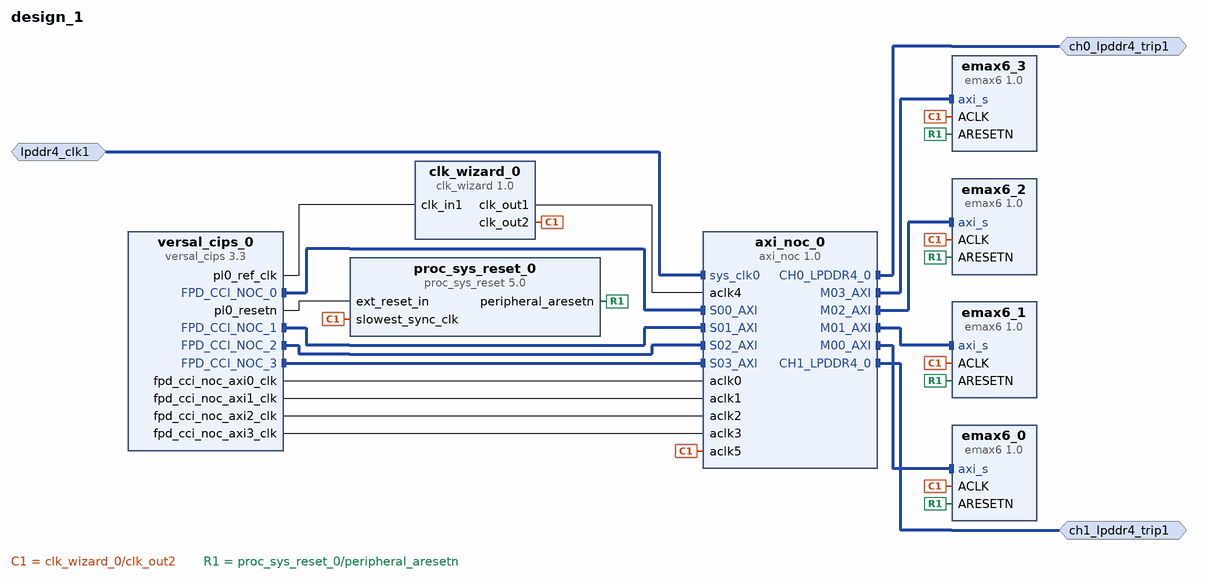
[diagram p0: block diagram of the top level]
# Vivado block design design_1, xcvp1802-lsvc4072-2MP-e-S, Vivado 2022.2.2
create_bd_design design_1

create_bd_intf_port -mode Master -vlnv xilinx.com:interface:lpddr4_rtl:1.0 ch0_lpddr4_trip1
create_bd_intf_port -mode Master -vlnv xilinx.com:interface:lpddr4_rtl:1.0 ch1_lpddr4_trip1
create_bd_intf_port -mode Slave -vlnv xilinx.com:interface:diff_clock_rtl:1.0 lpddr4_clk1
set_property -dict {CONFIG.FREQ_HZ 200000000} [get_bd_intf_ports lpddr4_clk1]

create_bd_cell -type ip -vlnv xilinx.com:ip:versal_cips:3.3 versal_cips_0
set_property -dict [list \
  CONFIG.BOOT_MODE Custom \
  CONFIG.CLOCK_MODE {REF CLK 33.33 MHz} \
  CONFIG.DDR_MEMORY_MODE Custom \
  CONFIG.DEBUG_MODE Custom \
  CONFIG.DESIGN_MODE 1 \
  CONFIG.PS_BOARD_INTERFACE Custom \
  CONFIG.PS_PMC_CONFIG {['CLOCK_MODE {REF CLK 33.33 MHz}', 'DDR_MEMORY_MODE Custom', 'DESIGN_MODE 1', 'DEVICE_INTEGRITY_MODE Custom', 'PMC_ALT_REF_CLK_FREQMHZ 33.333', 'PMC_CRP_EFUSE_REF_CTRL_SRCSEL IRO_CLK/4', 'PMC_CRP_HSM0_REF_CTRL_FREQMHZ 33.333', 'PMC_CRP_HSM1_REF_CTRL_FREQMHZ 133.333', 'PMC_CRP_LSBUS_REF_CTRL_FREQMHZ 100', 'PMC_CRP_NOC_REF_CTRL_FREQMHZ 960', 'PMC_CRP_PL0_REF_CTRL_FREQMHZ 100', 'PMC_CRP_PL5_REF_CTRL_FREQMHZ 400', 'PMC_GPIO0_MIO_PERIPHERAL {{ENABLE 1} {IO {PMC_MIO 0 .. 25}}}', 'PMC_GPIO1_MIO_PERIPHERAL {{ENABLE 1} {IO {PMC_MIO 26 .. 51}}}', 'PMC_MIO37 {{AUX_IO 0} {DIRECTION out} {DRIVE_STRENGTH 8mA} {OUTPUT_DATA high} {PULL pullup} {SCHMITT 0} {SLEW slow} {USAGE GPIO}}', 'PMC_PL_ALT_REF_CLK_FREQMHZ 33.333', 'PMC_QSPI_FBCLK {{ENABLE 1} {IO {PMC_MIO 6}}}', 'PMC_QSPI_PERIPHERAL_DATA_MODE x4', 'PMC_QSPI_PERIPHERAL_ENABLE 1', 'PMC_QSPI_PERIPHERAL_MODE {Dual Parallel}', 'PMC_REF_CLK_FREQMHZ 33.3333', 'PMC_SD1 {{CD_ENABLE 1} {CD_IO {PMC_MIO 28}} {POW_ENABLE 1} {POW_IO {PMC_MIO 51}} {RESET_ENABLE 0} {RESET_IO {PMC_MIO 12}} {WP_ENABLE 0} {WP_IO {PMC_MIO 1}}}', 'PMC_SD1_PERIPHERAL {{CLK_100_SDR_OTAP_DLY 0x3} {CLK_200_SDR_OTAP_DLY 0x2} {CLK_50_DDR_ITAP_DLY 0x2A} {CLK_50_DDR_OTAP_DLY 0x3} {CLK_50_SDR_ITAP_DLY 0x25} {CLK_50_SDR_OTAP_DLY 0x4} {ENABLE 1} {IO {PMC_MIO 26 .. 36}}}', 'PMC_SD1_SLOT_TYPE {SD 3.0 AUTODIR}', 'PMC_USE_PMC_NOC_AXI0 0', 'PS_BOARD_INTERFACE Custom', 'PS_ENET0_MDIO {{ENABLE 1} {IO {PS_MIO 24 .. 25}}}', 'PS_ENET0_PERIPHERAL {{ENABLE 1} {IO {PS_MIO 0 .. 11}}}', 'PS_GEN_IPI0_ENABLE 1', 'PS_GEN_IPI0_MASTER A72', 'PS_GEN_IPI1_ENABLE 1', 'PS_GEN_IPI2_ENABLE 1', 'PS_GEN_IPI3_ENABLE 1', 'PS_GEN_IPI4_ENABLE 1', 'PS_GEN_IPI5_ENABLE 1', 'PS_GEN_IPI6_ENABLE 1', 'PS_I2C0_PERIPHERAL {{ENABLE 1} {IO {PMC_MIO 46 .. 47}}}', 'PS_I2C1_PERIPHERAL {{ENABLE 1} {IO {PMC_MIO 44 .. 45}}}', 'PS_I2CSYSMON_PERIPHERAL {{ENABLE 0} {IO {PMC_MIO 39 .. 40}}}', 'PS_MIO7 {{AUX_IO 0} {DIRECTION in} {DRIVE_STRENGTH 8mA} {OUTPUT_DATA default} {PULL disable} {SCHMITT 0} {SLEW slow} {USAGE Reserved}}', 'PS_MIO9 {{AUX_IO 0} {DIRECTION in} {DRIVE_STRENGTH 8mA} {OUTPUT_DATA default} {PULL disable} {SCHMITT 0} {SLEW slow} {USAGE Reserved}}', 'PS_NUM_FABRIC_RESETS 1', 'PS_PCIE_RESET {{ENABLE 1}}', 'PS_UART0_PERIPHERAL {{ENABLE 1} {IO {PMC_MIO 42 .. 43}}}', 'PS_USB3_PERIPHERAL {{ENABLE 1} {IO {PMC_MIO 13 .. 25}}}', 'PS_USE_FPD_CCI_NOC 1', 'PS_USE_FPD_CCI_NOC0 1', 'PS_USE_NOC_LPD_AXI0 0', 'PS_USE_PMCPL_CLK0 1', 'PS_USE_PMCPL_CLK1 0', 'PS_USE_PMCPL_CLK2 0', 'PS_USE_PMCPL_CLK3 0', 'PS_USE_PMCPL_IRO_CLK 1', 'SMON_ALARMS Set_Alarms_On', 'SMON_ENABLE_TEMP_AVERAGING 0', 'SMON_INTERFACE_TO_USE I2C', 'SMON_PMBUS_ADDRESS 0x18', 'SMON_TEMP_AVERAGING_SAMPLES 0']} \
] [get_bd_cells versal_cips_0]
create_bd_cell -type ip -vlnv xilinx.com:ip:axi_noc:1.0 axi_noc_0
set_property -dict [list \
  CONFIG.CH0_LPDDR4_0_BOARD_INTERFACE ch0_lpddr4_trip1 \
  CONFIG.CH1_LPDDR4_0_BOARD_INTERFACE ch1_lpddr4_trip1 \
  CONFIG.MC1_FLIPPED_PINOUT true \
  CONFIG.MC_CHAN_REGION1 DDR_LOW1 \
  CONFIG.MC_DM_WIDTH 4 \
  CONFIG.MC_DQS_WIDTH 4 \
  CONFIG.MC_DQ_WIDTH 32 \
  CONFIG.MC_EN_INTR_RESP TRUE \
  CONFIG.MC_SYSTEM_CLOCK Differential \
  CONFIG.NUM_CLKS 6 \
  CONFIG.NUM_MC 1 \
  CONFIG.NUM_MCP 4 \
  CONFIG.NUM_MI 4 \
  CONFIG.NUM_NMI 0 \
  CONFIG.NUM_SI 4 \
  CONFIG.sys_clk0_BOARD_INTERFACE lpddr4_clk1 \
] [get_bd_cells axi_noc_0]
create_bd_cell -type ip -vlnv xilinx.com:ip:proc_sys_reset:5.0 proc_sys_reset_0
create_bd_cell -type ip -vlnv xilinx.com:ip:clk_wizard:1.0 clk_wizard_0
set_property -dict [list \
  CONFIG.CLKOUT_DRIVES BUFG,BUFG,BUFG,BUFG,BUFG,BUFG,BUFG \
  CONFIG.CLKOUT_DYN_PS None,None,None,None,None,None,None \
  CONFIG.CLKOUT_GROUPING Auto,Auto,Auto,Auto,Auto,Auto,Auto \
  CONFIG.CLKOUT_MATCHED_ROUTING false,false,false,false,false,false,false \
  CONFIG.CLKOUT_PORT clk_out1,clk_out2,clk_out3,clk_out4,clk_out5,clk_out6,clk_out7 \
  CONFIG.CLKOUT_REQUESTED_DUTY_CYCLE 50.000,50.000,50.000,50.000,50.000,50.000,50.000 \
  CONFIG.CLKOUT_REQUESTED_OUT_FREQUENCY 300,200,100.000,100.000,100.000,100.000,100.000 \
  CONFIG.CLKOUT_REQUESTED_PHASE 0.000,0.000,0.000,0.000,0.000,0.000,0.000 \
  CONFIG.CLKOUT_USED true,true,false,false,false,false,false \
] [get_bd_cells clk_wizard_0]
create_bd_cell -type ip -vlnv comparch:user:emax6:1.0 emax6_0
create_bd_cell -type ip -vlnv comparch:user:emax6:1.0 emax6_1
create_bd_cell -type ip -vlnv comparch:user:emax6:1.0 emax6_2
create_bd_cell -type ip -vlnv comparch:user:emax6:1.0 emax6_3

# ---- connections ----

connect_bd_intf_net [get_bd_intf_ports ch0_lpddr4_trip1] [get_bd_intf_pins axi_noc_0/CH0_LPDDR4_0]
connect_bd_intf_net [get_bd_intf_ports ch1_lpddr4_trip1] [get_bd_intf_pins axi_noc_0/CH1_LPDDR4_0]
connect_bd_intf_net [get_bd_intf_pins emax6_0/axi_s] [get_bd_intf_pins axi_noc_0/M00_AXI]
connect_bd_intf_net [get_bd_intf_pins emax6_1/axi_s] [get_bd_intf_pins axi_noc_0/M01_AXI]
connect_bd_intf_net [get_bd_intf_pins emax6_2/axi_s] [get_bd_intf_pins axi_noc_0/M02_AXI]
connect_bd_intf_net [get_bd_intf_pins emax6_3/axi_s] [get_bd_intf_pins axi_noc_0/M03_AXI]
connect_bd_intf_net -intf_net lpddr4_clk1_1 [get_bd_intf_ports lpddr4_clk1] [get_bd_intf_pins axi_noc_0/sys_clk0]
connect_bd_intf_net [get_bd_intf_pins versal_cips_0/FPD_CCI_NOC_0] [get_bd_intf_pins axi_noc_0/S00_AXI]
connect_bd_intf_net [get_bd_intf_pins versal_cips_0/FPD_CCI_NOC_1] [get_bd_intf_pins axi_noc_0/S01_AXI]
connect_bd_intf_net [get_bd_intf_pins versal_cips_0/FPD_CCI_NOC_2] [get_bd_intf_pins axi_noc_0/S02_AXI]
connect_bd_intf_net [get_bd_intf_pins versal_cips_0/FPD_CCI_NOC_3] [get_bd_intf_pins axi_noc_0/S03_AXI]
connect_bd_net [get_bd_pins clk_wizard_0/clk_out1] [get_bd_pins axi_noc_0/aclk4]
connect_bd_net [get_bd_pins clk_wizard_0/clk_out2] \
  [get_bd_pins emax6_0/ACLK] [get_bd_pins emax6_1/ACLK] [get_bd_pins emax6_2/ACLK] [get_bd_pins emax6_3/ACLK] \
  [get_bd_pins proc_sys_reset_0/slowest_sync_clk] [get_bd_pins axi_noc_0/aclk5]
connect_bd_net [get_bd_pins proc_sys_reset_0/peripheral_aresetn] \
  [get_bd_pins emax6_3/ARESETN] [get_bd_pins emax6_2/ARESETN] [get_bd_pins emax6_1/ARESETN] [get_bd_pins emax6_0/ARESETN]
connect_bd_net [get_bd_pins versal_cips_0/fpd_cci_noc_axi0_clk] [get_bd_pins axi_noc_0/aclk0]
connect_bd_net [get_bd_pins versal_cips_0/fpd_cci_noc_axi1_clk] [get_bd_pins axi_noc_0/aclk1]
connect_bd_net [get_bd_pins versal_cips_0/fpd_cci_noc_axi2_clk] [get_bd_pins axi_noc_0/aclk2]
connect_bd_net [get_bd_pins versal_cips_0/fpd_cci_noc_axi3_clk] [get_bd_pins axi_noc_0/aclk3]
connect_bd_net [get_bd_pins versal_cips_0/pl0_ref_clk] [get_bd_pins clk_wizard_0/clk_in1]
connect_bd_net [get_bd_pins versal_cips_0/pl0_resetn] [get_bd_pins proc_sys_reset_0/ext_reset_in]

# ---- address map ----
assign_bd_address -offset 0x0000000000000000 -range 2G -target_address_space [get_bd_addr_spaces versal_cips_0/FPD_CCI_NOC_0] [get_bd_addr_segs axi_noc_0/S00_AXI/C0_DDR_LOW0]
assign_bd_address -offset 0x0000000800000000 -range 2G -target_address_space [get_bd_addr_spaces versal_cips_0/FPD_CCI_NOC_0] [get_bd_addr_segs axi_noc_0/S00_AXI/C0_DDR_LOW1]
assign_bd_address -offset 0x0000020100000000 -range 4G -target_address_space [get_bd_addr_spaces versal_cips_0/FPD_CCI_NOC_0] [get_bd_addr_segs emax6_0/axi_s/reg0]
assign_bd_address -offset 0x0000000000000000 -range 2G -target_address_space [get_bd_addr_spaces versal_cips_0/FPD_CCI_NOC_1] [get_bd_addr_segs axi_noc_0/S01_AXI/C1_DDR_LOW0]
assign_bd_address -offset 0x0000000800000000 -range 2G -target_address_space [get_bd_addr_spaces versal_cips_0/FPD_CCI_NOC_1] [get_bd_addr_segs axi_noc_0/S01_AXI/C1_DDR_LOW1]
assign_bd_address -offset 0x0000020200000000 -range 4G -target_address_space [get_bd_addr_spaces versal_cips_0/FPD_CCI_NOC_1] [get_bd_addr_segs emax6_1/axi_s/reg0]
assign_bd_address -offset 0x0000000000000000 -range 2G -target_address_space [get_bd_addr_spaces versal_cips_0/FPD_CCI_NOC_2] [get_bd_addr_segs axi_noc_0/S02_AXI/C2_DDR_LOW0]
assign_bd_address -offset 0x0000000800000000 -range 2G -target_address_space [get_bd_addr_spaces versal_cips_0/FPD_CCI_NOC_2] [get_bd_addr_segs axi_noc_0/S02_AXI/C2_DDR_LOW1]
assign_bd_address -offset 0x0000020300000000 -range 4G -target_address_space [get_bd_addr_spaces versal_cips_0/FPD_CCI_NOC_2] [get_bd_addr_segs emax6_2/axi_s/reg0]
assign_bd_address -offset 0x0000000000000000 -range 2G -target_address_space [get_bd_addr_spaces versal_cips_0/FPD_CCI_NOC_3] [get_bd_addr_segs axi_noc_0/S03_AXI/C3_DDR_LOW0]
assign_bd_address -offset 0x0000000800000000 -range 2G -target_address_space [get_bd_addr_spaces versal_cips_0/FPD_CCI_NOC_3] [get_bd_addr_segs axi_noc_0/S03_AXI/C3_DDR_LOW1]
assign_bd_address -offset 0x00000204C0000000 -range 4G -target_address_space [get_bd_addr_spaces versal_cips_0/FPD_CCI_NOC_3] [get_bd_addr_segs emax6_3/axi_s/reg0]

validate_bd_design
save_bd_design
